# Altium schematic sheet Power.SchDoc
size B; SheetNumber: 2; SheetTotal: 2
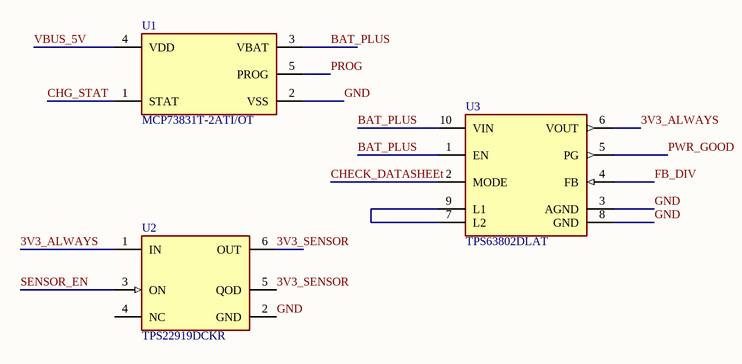
[diagram p0: Power.SchDoc]

## Parts
U1  MCP73831T-2ATI/OT  [FP-C04-091-OT-IPC_C]
U2  TPS22919DCKR  [FP-DCK0006A-MFG]
U3  TPS63802DLAT  [FP-DLA0010A-MFG]

## Nets
3V3_ALWAYS: U2.1(IN) U3.6(VOUT)
3V3_SENSOR: U2.5(QOD) U2.6(OUT)
BAT_PLUS: U1.3(VBAT) U3.1(EN) U3.10(VIN)
CHECK_DATASHEEt: U3.2(MODE)
CHG_STAT: U1.1(STAT)
FB_DIV: U3.4(FB)
GND: U1.2(VSS) U2.2(GND) U3.3(AGND) U3.8(GND)
PROG: U1.5(PROG)
PWR_GOOD: U3.5(PG)
SENSOR_EN: U2.3(ON)
VBUS_5V: U1.4(VDD)
NetU3_7: U3.7(L2) U3.9(L1)

Not connected (* = marked no-connect by the designer): U2 4(NC)

## Library data of the parts
U1 = CMP-0133-00144-2: IC CONTROLLR LI-ION 4.2V SOT23-5; Max Supply Voltage: 6V; Max Output Current: 500mA; Min Output Voltage: 4.168V; Max Output Voltage: 4.232V; Min Supply Voltage: 3.75V; Number of Cells: 1; Lead Free: Lead Free; Number of Pins: 5; Package Quantity: 3000; Min Operating Temperature: -40°C; Width: 1.8mm; Max Charge Current: 500mA; Output Current: 500mA; Packaging: Tape and Reel; Height: 1.3mm; Output Voltage: 4.2V; Max Operating Temperature: 85°C; Mount: Surface Mount; Case/Package: SOT-23; Length: 3.1mm; REACH SVHC: No SVHC
U2 = CMP-04912-000027-1: POWER MANAGEMENT
U3 = CMP-04918-000461-1: IC POWER MANAGEMENT; RoHS Compliant: Yes